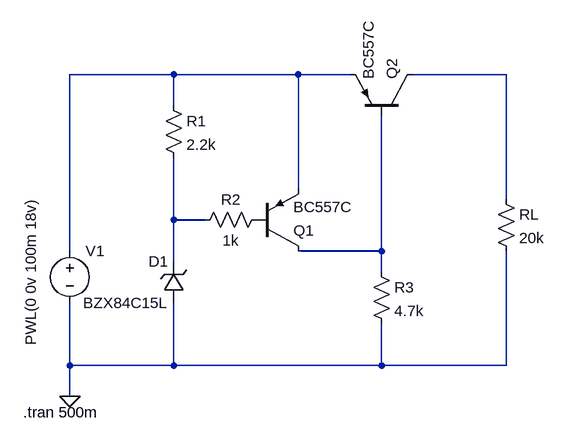
[diagram p0: schematic PNP bjt over voltage protection.asc]
PNP bjt over voltage protection.asc, the LTspice schematic file:
Version 4
SHEET 1 880 680
WIRE -32 -432 -192 -432
WIRE 160 -432 -32 -432
WIRE 240 -432 160 -432
WIRE 480 -432 336 -432
WIRE -32 -384 -32 -432
WIRE 160 -256 160 -432
WIRE 480 -240 480 -432
WIRE -32 -208 -32 -304
WIRE 16 -208 -32 -208
WIRE -192 -160 -192 -432
WIRE 288 -160 288 -368
WIRE 288 -160 160 -160
WIRE -32 -144 -32 -208
WIRE 288 -128 288 -160
WIRE -192 16 -192 -80
WIRE -32 16 -32 -80
WIRE -32 16 -192 16
WIRE 288 16 288 -48
WIRE 288 16 -32 16
WIRE 480 16 480 -160
WIRE 480 16 288 16
WIRE -192 64 -192 16
FLAG -192 64 0
SYMBOL voltage -192 -176 R0
WINDOW 3 -60 -66 VRight 2
WINDOW 123 0 0 Left 0
WINDOW 39 0 0 Left 0
SYMATTR InstName V1
SYMATTR Value PWL(0 0v 100m 18v)
SYMBOL zener -16 -80 R180
WINDOW 0 24 64 Left 2
WINDOW 3 24 0 Left 2
SYMATTR InstName D1
SYMATTR Value BZX84C15L
SYMBOL res -48 -400 R0
SYMATTR InstName R1
SYMATTR Value 2.2k
SYMBOL res 112 -224 R90
WINDOW 0 0 56 VBottom 2
WINDOW 3 32 56 VTop 2
SYMATTR InstName R2
SYMATTR Value 1k
SYMBOL pnp 96 -160 M180
SYMATTR InstName Q1
SYMATTR Value BC557C
SYMBOL pnp 336 -368 M270
SYMATTR InstName Q2
SYMATTR Value BC557C
SYMBOL res 464 -256 R0
SYMATTR InstName RL
SYMATTR Value 20k
SYMBOL res 272 -144 R0
SYMATTR InstName R3
SYMATTR Value 4.7k
TEXT -264 88 Left 2 !.tran 500m

The netlist it stands for:
* PNP bjt over voltage protection.asc
V1 N001 0 PWL(0 0v 100m 18v)
D1 0 N003 BZX84C15L
R1 N001 N003 2.2k
R2 P001 N003 1k
Q1 N004 P001 N001 0 BC557C
Q2 N002 N004 N001 0 BC557C
RL N002 0 20k
R3 N004 0 4.7k
.model D D
.lib standard.dio
.model NPN NPN
.model PNP PNP
.lib standard.bjt
.tran 500m
.backanno
.end